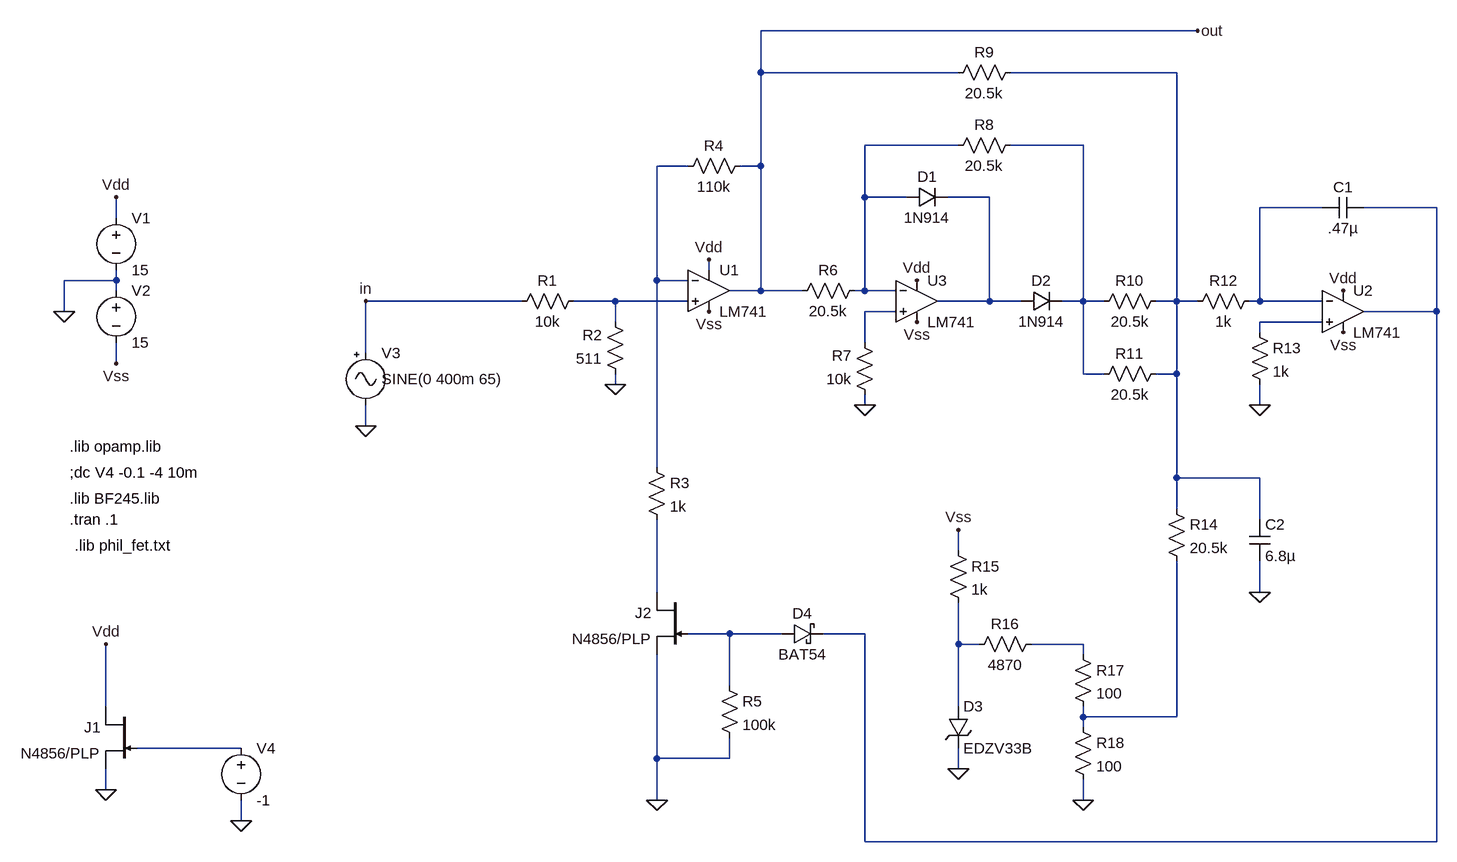
[diagram p0: schematic agc_livro.asc]
agc_livro.asc, the LTspice schematic file:
Version 4
SHEET 1 1464 1100
WIRE 864 -448 192 -448
WIRE 192 -384 192 -448
WIRE 496 -384 192 -384
WIRE 832 -384 576 -384
WIRE 496 -272 352 -272
WIRE 688 -272 576 -272
WIRE 80 -240 32 -240
WIRE 192 -240 192 -384
WIRE 192 -240 160 -240
WIRE 352 -192 352 -272
WIRE 416 -192 352 -192
WIRE 544 -192 480 -192
WIRE 1056 -176 960 -176
WIRE 1232 -176 1120 -176
WIRE -800 -160 -800 -192
WIRE 112 -80 112 -96
WIRE -800 -64 -800 -80
WIRE -800 -64 -880 -64
WIRE 32 -64 32 -240
WIRE 80 -64 32 -64
WIRE -800 -48 -800 -64
WIRE 192 -48 192 -240
WIRE 192 -48 144 -48
WIRE 256 -48 192 -48
WIRE 352 -48 352 -192
WIRE 352 -48 336 -48
WIRE 400 -48 352 -48
WIRE -176 -32 -416 -32
WIRE -32 -32 -96 -32
WIRE 80 -32 -32 -32
WIRE 544 -32 544 -192
WIRE 544 -32 464 -32
WIRE 592 -32 544 -32
WIRE 688 -32 688 -272
WIRE 688 -32 656 -32
WIRE 720 -32 688 -32
WIRE 832 -32 832 -384
WIRE 832 -32 800 -32
WIRE 864 -32 832 -32
WIRE 960 -32 960 -176
WIRE 960 -32 944 -32
WIRE 1056 -32 960 -32
WIRE -880 -16 -880 -64
WIRE 400 -16 352 -16
WIRE 1232 -16 1232 -176
WIRE 1232 -16 1120 -16
WIRE -32 0 -32 -32
WIRE 1056 0 960 0
WIRE 960 16 960 0
WIRE 352 32 352 -16
WIRE -416 48 -416 -32
WIRE -800 64 -800 32
WIRE 688 80 688 -32
WIRE 720 80 688 80
WIRE 832 80 832 -32
WIRE 832 80 800 80
WIRE -32 96 -32 80
WIRE 352 128 352 112
WIRE 960 128 960 96
WIRE -416 160 -416 128
WIRE 32 224 32 -64
WIRE 832 240 832 80
WIRE 960 240 832 240
WIRE 832 288 832 240
WIRE 960 304 960 240
WIRE 496 352 496 320
WIRE 32 416 32 304
WIRE 960 416 960 368
WIRE 144 480 80 480
WIRE 224 480 144 480
WIRE 352 480 288 480
WIRE 496 496 496 432
WIRE 528 496 496 496
WIRE 688 496 608 496
WIRE 688 512 688 496
WIRE 144 560 144 480
WIRE -816 592 -816 496
WIRE 496 592 496 496
WIRE 688 608 688 592
WIRE 832 608 832 368
WIRE 832 608 688 608
WIRE 688 624 688 608
WIRE -608 656 -768 656
WIRE 32 672 32 512
WIRE 144 672 144 640
WIRE 144 672 32 672
WIRE 496 688 496 656
WIRE -816 720 -816 688
WIRE 32 736 32 672
WIRE 688 736 688 704
WIRE -608 768 -608 736
WIRE 352 800 352 480
WIRE 1232 800 1232 -16
WIRE 1232 800 352 800
FLAG -880 -16 0
FLAG -800 -192 Vdd
FLAG 112 -96 Vdd
FLAG -800 64 Vss
FLAG -416 160 0
FLAG 864 -448 out
FLAG -416 -32 in
FLAG -816 720 0
FLAG -816 496 Vdd
FLAG -608 768 0
FLAG 432 0 Vss
FLAG 432 -64 Vdd
FLAG 32 736 0
FLAG 1088 -48 Vdd
FLAG 1088 16 Vss
FLAG 960 128 0
FLAG 112 -16 Vss
FLAG -32 96 0
FLAG 352 128 0
FLAG 960 416 0
FLAG 688 736 0
FLAG 496 688 0
FLAG 496 320 Vss
SYMBOL voltage -800 -176 R0
SYMATTR InstName V1
SYMATTR Value 15
SYMBOL voltage -800 -64 R0
SYMATTR InstName V2
SYMATTR Value 15
SYMBOL Misc\\signal -416 32 R0
WINDOW 123 24 144 Left 2
WINDOW 39 0 0 Left 2
WINDOW 3 24 56 Left 2
SYMATTR Value SINE(0 400m 65)
SYMATTR InstName V3
SYMBOL njf -768 592 M0
SYMATTR InstName J1
SYMATTR Value N4856/PLP
SYMBOL voltage -608 640 R0
SYMATTR InstName V4
SYMATTR Value -1
SYMBOL Opamps\\opamp2 112 -112 R0
SYMATTR InstName U1
SYMATTR Value LM741
SYMBOL Opamps\\opamp2 432 -96 R0
SYMATTR InstName U3
SYMATTR Value LM741
SYMBOL njf 80 416 M0
SYMATTR InstName J2
SYMATTR Value N4856/PLP
SYMBOL res 128 544 R0
SYMATTR InstName R5
SYMATTR Value 100k
SYMBOL Opamps\\opamp2 1088 -80 R0
SYMATTR InstName U2
SYMATTR Value LM741
SYMBOL res -80 -48 R90
WINDOW 0 0 56 VBottom 2
WINDOW 3 32 56 VTop 2
SYMATTR InstName R1
SYMATTR Value 10k
SYMBOL res -16 96 R180
WINDOW 0 36 76 Left 2
WINDOW 3 36 40 Left 2
SYMATTR InstName R2
SYMATTR Value 511
SYMBOL res 16 208 R0
SYMATTR InstName R3
SYMATTR Value 1k
SYMBOL res 176 -256 R90
WINDOW 0 0 56 VBottom 2
WINDOW 3 32 56 VTop 2
SYMATTR InstName R4
SYMATTR Value 110k
SYMBOL res 352 -64 R90
WINDOW 0 0 56 VBottom 2
WINDOW 3 32 56 VTop 2
SYMATTR InstName R6
SYMATTR Value 20.5k
SYMBOL res 368 128 R180
WINDOW 0 36 76 Left 2
WINDOW 3 36 40 Left 2
SYMATTR InstName R7
SYMATTR Value 10k
SYMBOL diode 416 -176 R270
WINDOW 0 32 32 VTop 2
WINDOW 3 0 32 VBottom 2
SYMATTR InstName D1
SYMATTR Value 1N914
SYMBOL diode 592 -16 R270
WINDOW 0 32 32 VTop 2
WINDOW 3 0 32 VBottom 2
SYMATTR InstName D2
SYMATTR Value 1N914
SYMBOL res 592 -288 R90
WINDOW 0 0 56 VBottom 2
WINDOW 3 32 56 VTop 2
SYMATTR InstName R8
SYMATTR Value 20.5k
SYMBOL res 592 -400 R90
WINDOW 0 0 56 VBottom 2
WINDOW 3 32 56 VTop 2
SYMATTR InstName R9
SYMATTR Value 20.5k
SYMBOL res 816 -48 R90
WINDOW 0 0 56 VBottom 2
WINDOW 3 32 56 VTop 2
SYMATTR InstName R10
SYMATTR Value 20.5k
SYMBOL res 816 64 R90
WINDOW 0 0 56 VBottom 2
WINDOW 3 32 56 VTop 2
SYMATTR InstName R11
SYMATTR Value 20.5k
SYMBOL res 960 -48 R90
WINDOW 0 0 56 VBottom 2
WINDOW 3 32 56 VTop 2
SYMATTR InstName R12
SYMATTR Value 1k
SYMBOL res 944 0 R0
SYMATTR InstName R13
SYMATTR Value 1k
SYMBOL cap 1120 -192 R90
WINDOW 0 0 32 VBottom 2
WINDOW 3 32 32 VTop 2
SYMATTR InstName C1
SYMATTR Value .47µ
SYMBOL res 816 272 R0
SYMATTR InstName R14
SYMATTR Value 20.5k
SYMBOL cap 944 304 R0
SYMATTR InstName C2
SYMATTR Value 6.8µ
SYMBOL res 480 336 R0
SYMATTR InstName R15
SYMATTR Value 1k
SYMBOL res 624 480 R90
WINDOW 0 0 56 VBottom 2
WINDOW 3 32 56 VTop 2
SYMATTR InstName R16
SYMATTR Value 4870
SYMBOL res 672 496 R0
SYMATTR InstName R17
SYMATTR Value 100
SYMBOL res 672 608 R0
SYMATTR InstName R18
SYMATTR Value 100
SYMBOL zener 480 592 R0
SYMATTR InstName D3
SYMATTR Value EDZV33B
SYMATTR Description Diode
SYMATTR Type diode
SYMBOL schottky 224 496 R270
WINDOW 0 32 32 VTop 2
WINDOW 3 0 32 VBottom 2
SYMATTR InstName D4
SYMATTR Value BAT54
SYMATTR Description Diode
SYMATTR Type diode
TEXT -872 232 Left 2 !;dc V4 -0.1 -4 10m
TEXT -872 192 Left 2 !.lib opamp.lib
TEXT -872 272 Left 2 !.lib BF245.lib
TEXT -872 304 Left 2 !.tran .1
TEXT -864 344 Left 2 !.lib phil_fet.txt

The netlist it stands for:
* agc_livro.asc
V1 Vdd 0 15
V2 0 Vss 15
V3 in 0 SINE(0 400m 65)
J1 Vdd N016 0 N4856/PLP
V4 N016 0 -1
XU1 N008 N004 Vdd Vss out LM741  ; pins In+ In- V+ V- OUT
XU3 N009 N002 Vdd Vss N005 LM741  ; pins In+ In- V+ V- OUT
J2 N011 N012 0 N4856/PLP
R5 N012 0 100k
XU2 N010 N006 Vdd Vss N007 LM741  ; pins In+ In- V+ V- OUT
R1 N008 in 10k
R2 0 N008 511
R3 N004 N011 1k
R4 out N004 110k
R6 N002 out 20.5k
R7 0 N009 10k
D1 N002 N005 1N914
D2 N005 N003 1N914
R8 N003 N002 20.5k
R9 N001 out 20.5k
R10 N001 N003 20.5k
R11 N001 N003 20.5k
R12 N006 N001 1k
R13 N010 0 1k
C1 N007 N006 .47µ
R14 N001 N015 20.5k
C2 N001 0 6.8µ
R15 Vss N013 1k
R16 N014 N013 4870
R17 N014 N015 100
R18 N015 0 100
D3 N013 0 EDZV33B
D4 N012 N007 BAT54
.model D D
.lib standard.dio
.model NJF NJF
.model PJF PJF
.lib standard.jft
;dc V4 -0.1 -4 10m
.lib opamp.lib
.lib BF245.lib
.tran .1
.lib phil_fet.txt
.backanno
.end